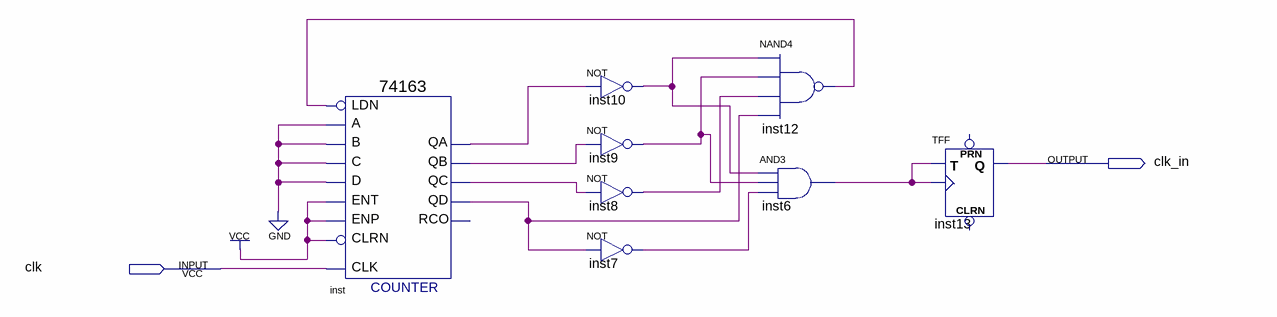
[diagram p0: schematic sheet]
// Quartus schematic Block1_1.bdf as structural Verilog: 8 symbols, 2 pins
module Block1_1 (
  input  clk,
  output clk_in
);

  wire inst6_out, inst7_out, inst8_out, inst9_out, inst10_out, inst12_out, inst_qa, inst_qb, inst_qc, inst_qd;

  \74163  inst (
    .C(1'b0), .B(1'b0), .A(1'b0), .ENT(1'b1), .D(1'b0), .CLRN(1'b1), .CLK(clk), .ENP(1'b1), .LDN(inst12_out),
    .QA(inst_qa), .QB(inst_qb), .QC(inst_qc), .QD(inst_qd));  // open: RCO
  not inst10 (inst10_out, inst_qa);
  not inst9 (inst9_out, inst_qb);
  not inst8 (inst8_out, inst_qc);
  not inst7 (inst7_out, inst_qd);
  nand inst12 (inst12_out, inst10_out, inst9_out, inst8_out, inst_qd);
  and inst6 (inst6_out, inst10_out, inst9_out, inst7_out);
  TFF inst13 (.T(inst6_out), .CLK(inst6_out), .Q(clk_in));  // open: PRN, CLRN
endmodule
